# EAGLE schematic LED-painel (EAGLE 6.1)
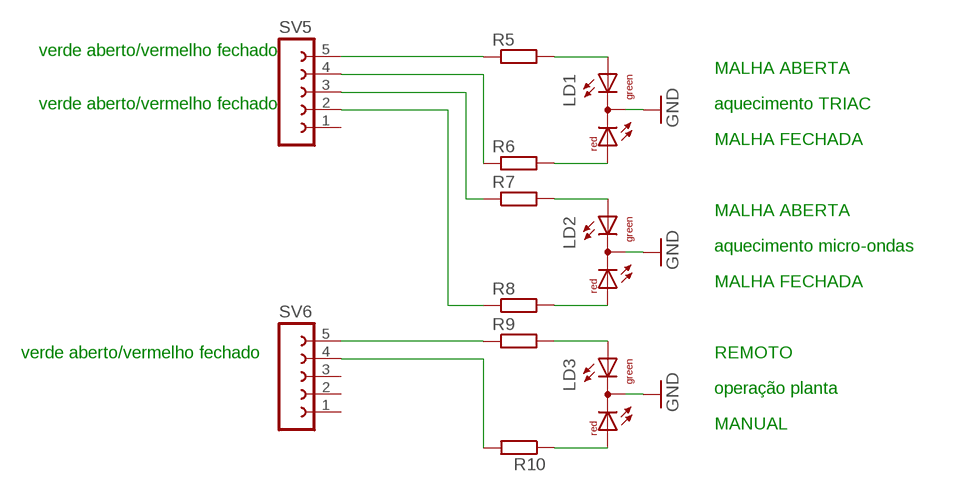
[diagram p0: schematic, sheet 1]

## Parts
LD1  DUOLED-RG-C  [DUOLED-C-5MM]
LD2  DUOLED-RG-C  [DUOLED-C-5MM]
LD3  DUOLED-RG-C  [DUOLED-C-5MM]
R5  R-EU_0207/10  [0207/10]
R6  R-EU_0207/10  [0207/10]
R7  R-EU_0207/10  [0207/10]
R8  R-EU_0207/10  [0207/10]
R9  R-EU_0207/10  [0207/10]
R10  R-EU_0207/10  [0207/10]
SV5  FE05-1  [FE05-1]
SV6  FE05-1  [FE05-1]

## Nets
GND: LD1.C LD2.C LD3.C
N$8: LD1.AX(AG) R5.2
N$9: LD1.AR R6.2
N$10: LD2.AX(AG) R7.2
N$11: LD2.AR R8.2
N$12: R5.1 SV5.5
N$13: R6.1 SV5.4
N$14: R7.1 SV5.3
N$15: R8.1 SV5.2
N$16: LD3.AX(AG) R9.2
N$17: LD3.AR R10.1
N$18: R9.1 SV6.5
N$19: R10.2 SV6.4
Unconnected: SV5.1 SV6.1 SV6.2 SV6.3

## Notes on the sheet
- verde aberto/vermelho fechado
- MALHA ABERTA
- verde aberto/vermelho fechado | aquecimento TRIAC
- MALHA FECHADA
- MALHA ABERTA
- aquecimento micro-ondas
- MALHA FECHADA
- verde aberto/vermelho fechado | REMOTO
- operação planta
- MANUAL

## Library data of the parts
LD1-LD3 = led:DUOLED-RG-C: DUO LED 2 colors (red/green), 5 mm, round, common Cathode www.ligitek.com or other producers.
R5-R9 = resistor:R-EU_: RESISTOR, European symbol
R10 = rcl:R-EU_: RESISTOR, European symbol
SV5 SV6 = con-lsta:FE05-1: FEMALE HEADER; OC_FARNELL: unknown; OC_NEWARK: unknown